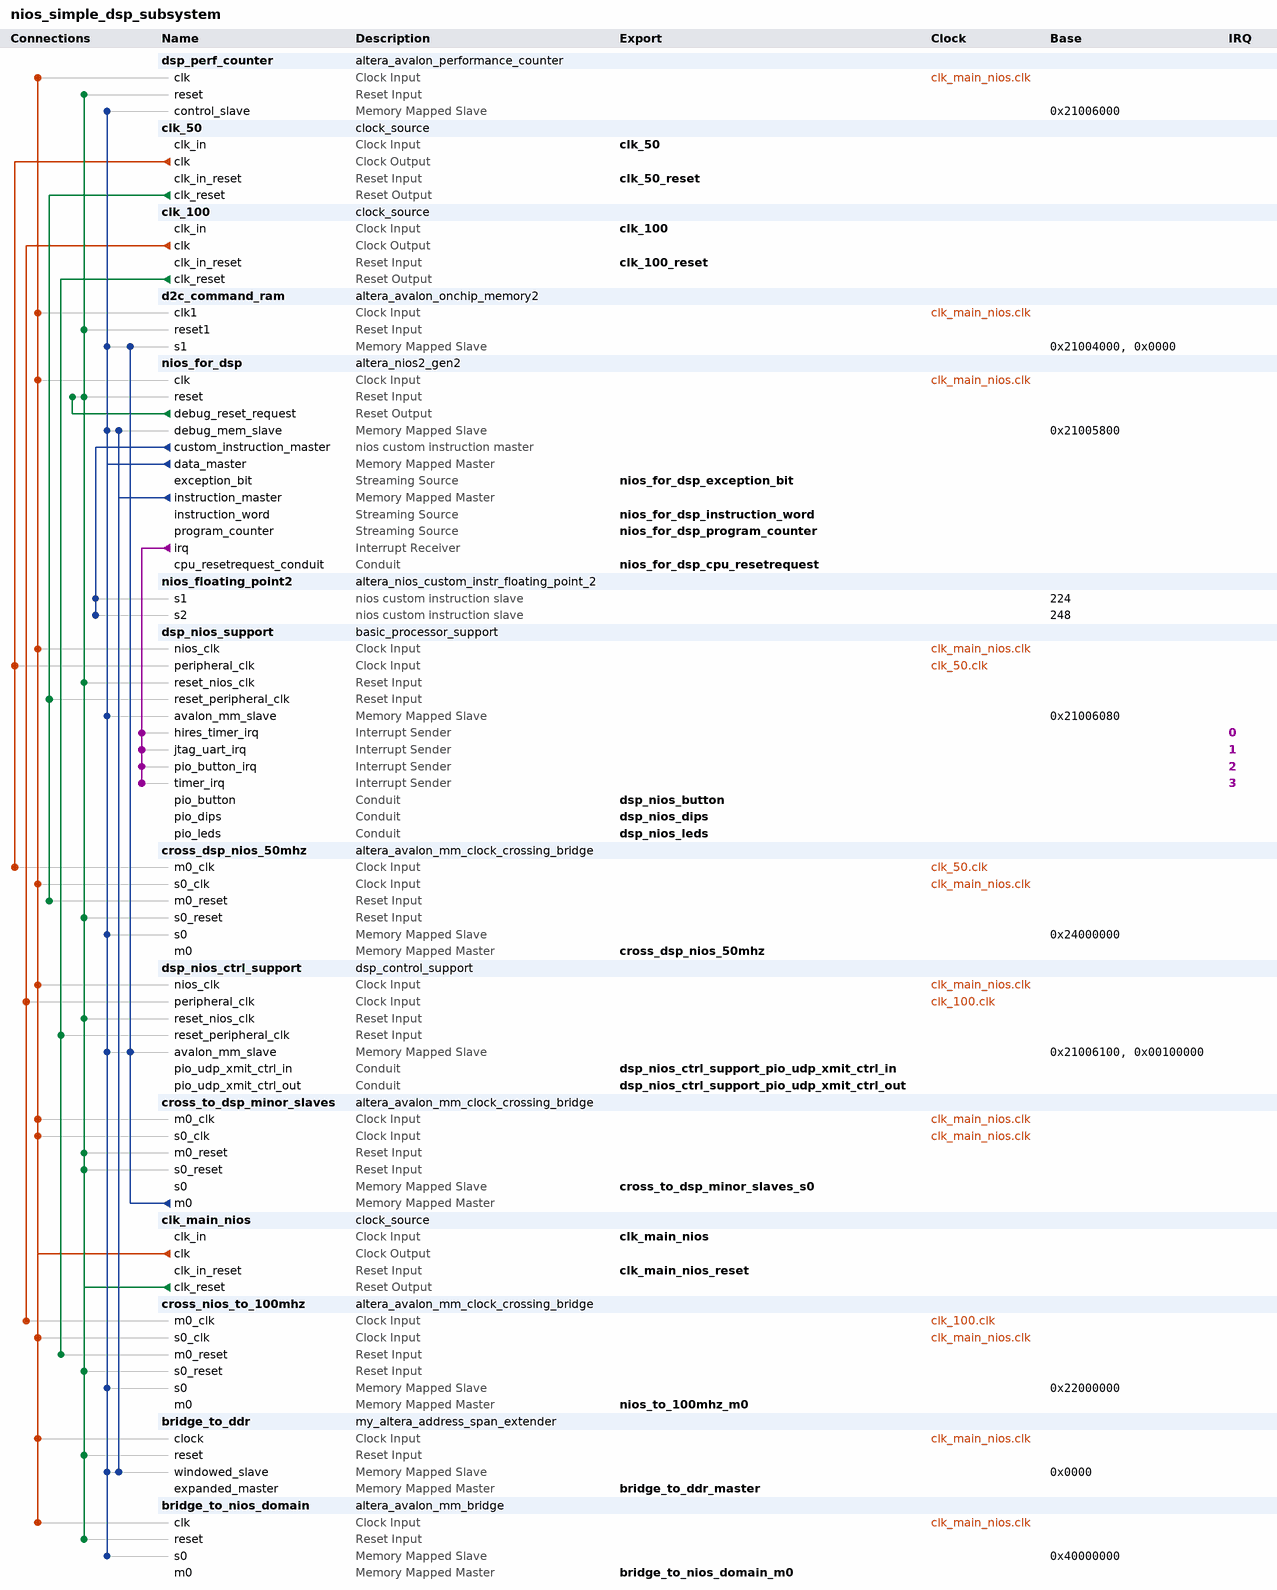
[diagram p0: system contents]
# Platform Designer (Qsys) system nios_simple_dsp_subsystem, Arria V 5AGXFB5H4F35C4
# Parameters at their usual value, and those the tool derives, are not listed.
package require -exact qsys 16.1
create_system nios_simple_dsp_subsystem
set_project_property DEVICE_FAMILY {Arria V}
set_project_property DEVICE 5AGXFB5H4F35C4

add_instance dsp_perf_counter altera_avalon_performance_counter 16.1
set_instance_parameter_value dsp_perf_counter numberOfSections 7

add_instance clk_50 clock_source 16.1
set_instance_parameter_value clk_50 clockFrequency 50000000
set_instance_parameter_value clk_50 resetSynchronousEdges BOTH

add_instance clk_100 clock_source 16.1
set_instance_parameter_value clk_100 clockFrequency 100000000
set_instance_parameter_value clk_100 resetSynchronousEdges BOTH

add_instance d2c_command_ram altera_avalon_onchip_memory2 16.1
set_instance_parameter_value d2c_command_ram allowInSystemMemoryContentEditor true
set_instance_parameter_value d2c_command_ram dataWidth 32
set_instance_parameter_value d2c_command_ram dualPort false
set_instance_parameter_value d2c_command_ram initMemContent true
set_instance_parameter_value d2c_command_ram initializationFileName onchip_mem.hex
set_instance_parameter_value d2c_command_ram instanceID d2c
set_instance_parameter_value d2c_command_ram memorySize 4096
set_instance_parameter_value d2c_command_ram slave1Latency 2

add_instance nios_for_dsp altera_nios2_gen2 16.1
set_instance_parameter_value nios_for_dsp cpuID 3419
set_instance_parameter_value nios_for_dsp cpuReset true
set_instance_parameter_value nios_for_dsp dcache_size 0
set_instance_parameter_value nios_for_dsp dividerType srt2
set_instance_parameter_value nios_for_dsp exceptionSlave bridge_to_ddr.windowed_slave
set_instance_parameter_value nios_for_dsp icache_burstType Sequential
set_instance_parameter_value nios_for_dsp icache_size 16384
set_instance_parameter_value nios_for_dsp impl Fast
set_instance_parameter_value nios_for_dsp mul_32_impl 3
set_instance_parameter_value nios_for_dsp mul_shift_choice 1
set_instance_parameter_value nios_for_dsp resetSlave bridge_to_ddr.windowed_slave
set_instance_parameter_value nios_for_dsp setting_showUnpublishedSettings true
set_instance_parameter_value nios_for_dsp setting_support31bitdcachebypass false

add_instance nios_floating_point2 altera_nios_custom_instr_floating_point_2 16.1
set_instance_parameter_value nios_floating_point2 arithmetic_present true
set_instance_parameter_value nios_floating_point2 comparison_present true
set_instance_parameter_value nios_floating_point2 conversion_present true
set_instance_parameter_value nios_floating_point2 root_present true

add_instance dsp_nios_support basic_processor_support 1.0

add_instance cross_dsp_nios_50mhz altera_avalon_mm_clock_crossing_bridge 16.1
set_instance_parameter_value cross_dsp_nios_50mhz ADDRESS_WIDTH 10
set_instance_parameter_value cross_dsp_nios_50mhz COMMAND_FIFO_DEPTH 4
set_instance_parameter_value cross_dsp_nios_50mhz DATA_WIDTH 32
set_instance_parameter_value cross_dsp_nios_50mhz MASTER_SYNC_DEPTH 2
set_instance_parameter_value cross_dsp_nios_50mhz MAX_BURST_SIZE 1
set_instance_parameter_value cross_dsp_nios_50mhz RESPONSE_FIFO_DEPTH 4
set_instance_parameter_value cross_dsp_nios_50mhz SLAVE_SYNC_DEPTH 2
set_instance_parameter_value cross_dsp_nios_50mhz USE_AUTO_ADDRESS_WIDTH 1

add_instance dsp_nios_ctrl_support dsp_control_support 1.0

add_instance cross_to_dsp_minor_slaves altera_avalon_mm_clock_crossing_bridge 16.1
set_instance_parameter_value cross_to_dsp_minor_slaves ADDRESS_WIDTH 10
set_instance_parameter_value cross_to_dsp_minor_slaves COMMAND_FIFO_DEPTH 16
set_instance_parameter_value cross_to_dsp_minor_slaves DATA_WIDTH 128
set_instance_parameter_value cross_to_dsp_minor_slaves MASTER_SYNC_DEPTH 2
set_instance_parameter_value cross_to_dsp_minor_slaves MAX_BURST_SIZE 1
set_instance_parameter_value cross_to_dsp_minor_slaves RESPONSE_FIFO_DEPTH 16
set_instance_parameter_value cross_to_dsp_minor_slaves SLAVE_SYNC_DEPTH 2
set_instance_parameter_value cross_to_dsp_minor_slaves USE_AUTO_ADDRESS_WIDTH 1

add_instance clk_main_nios clock_source 16.1
set_instance_parameter_value clk_main_nios clockFrequency 150000000
set_instance_parameter_value clk_main_nios resetSynchronousEdges BOTH

add_instance cross_nios_to_100mhz altera_avalon_mm_clock_crossing_bridge 16.1
set_instance_parameter_value cross_nios_to_100mhz ADDRESS_WIDTH 28
set_instance_parameter_value cross_nios_to_100mhz COMMAND_FIFO_DEPTH 4
set_instance_parameter_value cross_nios_to_100mhz DATA_WIDTH 32
set_instance_parameter_value cross_nios_to_100mhz MASTER_SYNC_DEPTH 2
set_instance_parameter_value cross_nios_to_100mhz MAX_BURST_SIZE 1
set_instance_parameter_value cross_nios_to_100mhz RESPONSE_FIFO_DEPTH 4
set_instance_parameter_value cross_nios_to_100mhz SLAVE_SYNC_DEPTH 2
set_instance_parameter_value cross_nios_to_100mhz USE_AUTO_ADDRESS_WIDTH 1

add_instance bridge_to_ddr my_altera_address_span_extender 16.1
set_instance_parameter_value bridge_to_ddr BURSTCOUNT_WIDTH 4
set_instance_parameter_value bridge_to_ddr DATA_WIDTH 256
set_instance_parameter_value bridge_to_ddr ENABLE_SLAVE_PORT true
set_instance_parameter_value bridge_to_ddr MASTER_ADDRESS_DEF 0
set_instance_parameter_value bridge_to_ddr MASTER_ADDRESS_WIDTH 32
set_instance_parameter_value bridge_to_ddr MAX_PENDING_READS 32
set_instance_parameter_value bridge_to_ddr SLAVE_ADDRESS_WIDTH 24
set_instance_parameter_value bridge_to_ddr SUB_WINDOW_COUNT 1

add_instance bridge_to_nios_domain altera_avalon_mm_bridge 16.1
set_instance_parameter_value bridge_to_nios_domain ADDRESS_UNITS SYMBOLS
set_instance_parameter_value bridge_to_nios_domain ADDRESS_WIDTH 10
set_instance_parameter_value bridge_to_nios_domain DATA_WIDTH 32
set_instance_parameter_value bridge_to_nios_domain MAX_PENDING_RESPONSES 4
set_instance_parameter_value bridge_to_nios_domain USE_AUTO_ADDRESS_WIDTH 1

# connections
add_connection clk_50.clk cross_dsp_nios_50mhz.m0_clk clock
add_connection clk_50.clk dsp_nios_support.peripheral_clk clock
add_connection clk_100.clk cross_nios_to_100mhz.m0_clk clock
add_connection clk_100.clk dsp_nios_ctrl_support.peripheral_clk clock
add_connection clk_main_nios.clk bridge_to_ddr.clock clock
add_connection clk_main_nios.clk bridge_to_nios_domain.clk clock
add_connection clk_main_nios.clk cross_dsp_nios_50mhz.s0_clk clock
add_connection clk_main_nios.clk cross_nios_to_100mhz.s0_clk clock
add_connection clk_main_nios.clk cross_to_dsp_minor_slaves.m0_clk clock
add_connection clk_main_nios.clk cross_to_dsp_minor_slaves.s0_clk clock
add_connection clk_main_nios.clk d2c_command_ram.clk1 clock
add_connection clk_main_nios.clk dsp_nios_ctrl_support.nios_clk clock
add_connection clk_main_nios.clk dsp_nios_support.nios_clk clock
add_connection clk_main_nios.clk dsp_perf_counter.clk clock
add_connection clk_main_nios.clk nios_for_dsp.clk clock
add_connection clk_50.clk_reset cross_dsp_nios_50mhz.m0_reset reset
add_connection clk_50.clk_reset dsp_nios_support.reset_peripheral_clk reset
add_connection clk_100.clk_reset cross_nios_to_100mhz.m0_reset reset
add_connection clk_100.clk_reset dsp_nios_ctrl_support.reset_peripheral_clk reset
add_connection clk_main_nios.clk_reset bridge_to_ddr.reset reset
add_connection clk_main_nios.clk_reset bridge_to_nios_domain.reset reset
add_connection clk_main_nios.clk_reset cross_dsp_nios_50mhz.s0_reset reset
add_connection clk_main_nios.clk_reset cross_nios_to_100mhz.s0_reset reset
add_connection clk_main_nios.clk_reset cross_to_dsp_minor_slaves.m0_reset reset
add_connection clk_main_nios.clk_reset cross_to_dsp_minor_slaves.s0_reset reset
add_connection clk_main_nios.clk_reset d2c_command_ram.reset1 reset
add_connection clk_main_nios.clk_reset dsp_nios_ctrl_support.reset_nios_clk reset
add_connection clk_main_nios.clk_reset dsp_nios_support.reset_nios_clk reset
add_connection clk_main_nios.clk_reset dsp_perf_counter.reset reset
add_connection clk_main_nios.clk_reset nios_for_dsp.reset reset
add_connection nios_for_dsp.debug_reset_request nios_for_dsp.reset reset
add_connection cross_to_dsp_minor_slaves.m0 d2c_command_ram.s1 avalon
set_connection_parameter_value cross_to_dsp_minor_slaves.m0/d2c_command_ram.s1 baseAddress 0x0000
add_connection cross_to_dsp_minor_slaves.m0 dsp_nios_ctrl_support.avalon_mm_slave avalon
set_connection_parameter_value cross_to_dsp_minor_slaves.m0/dsp_nios_ctrl_support.avalon_mm_slave baseAddress 0x00100000
add_connection nios_for_dsp.data_master bridge_to_ddr.windowed_slave avalon
set_connection_parameter_value nios_for_dsp.data_master/bridge_to_ddr.windowed_slave baseAddress 0x0000
add_connection nios_for_dsp.data_master bridge_to_nios_domain.s0 avalon
set_connection_parameter_value nios_for_dsp.data_master/bridge_to_nios_domain.s0 baseAddress 0x40000000
add_connection nios_for_dsp.data_master cross_dsp_nios_50mhz.s0 avalon
set_connection_parameter_value nios_for_dsp.data_master/cross_dsp_nios_50mhz.s0 baseAddress 0x24000000
add_connection nios_for_dsp.data_master cross_nios_to_100mhz.s0 avalon
set_connection_parameter_value nios_for_dsp.data_master/cross_nios_to_100mhz.s0 baseAddress 0x22000000
add_connection nios_for_dsp.data_master d2c_command_ram.s1 avalon
set_connection_parameter_value nios_for_dsp.data_master/d2c_command_ram.s1 baseAddress 0x21004000
add_connection nios_for_dsp.data_master dsp_nios_ctrl_support.avalon_mm_slave avalon
set_connection_parameter_value nios_for_dsp.data_master/dsp_nios_ctrl_support.avalon_mm_slave baseAddress 0x21006100
add_connection nios_for_dsp.data_master dsp_nios_support.avalon_mm_slave avalon
set_connection_parameter_value nios_for_dsp.data_master/dsp_nios_support.avalon_mm_slave baseAddress 0x21006080
add_connection nios_for_dsp.data_master dsp_perf_counter.control_slave avalon
set_connection_parameter_value nios_for_dsp.data_master/dsp_perf_counter.control_slave baseAddress 0x21006000
add_connection nios_for_dsp.data_master nios_for_dsp.debug_mem_slave avalon
set_connection_parameter_value nios_for_dsp.data_master/nios_for_dsp.debug_mem_slave baseAddress 0x21005800
add_connection nios_for_dsp.instruction_master bridge_to_ddr.windowed_slave avalon
set_connection_parameter_value nios_for_dsp.instruction_master/bridge_to_ddr.windowed_slave baseAddress 0x0000
add_connection nios_for_dsp.instruction_master nios_for_dsp.debug_mem_slave avalon
set_connection_parameter_value nios_for_dsp.instruction_master/nios_for_dsp.debug_mem_slave baseAddress 0x21005800
add_connection nios_for_dsp.irq dsp_nios_support.hires_timer_irq interrupt
set_connection_parameter_value nios_for_dsp.irq/dsp_nios_support.hires_timer_irq irqNumber 0
add_connection nios_for_dsp.irq dsp_nios_support.jtag_uart_irq interrupt
set_connection_parameter_value nios_for_dsp.irq/dsp_nios_support.jtag_uart_irq irqNumber 1
add_connection nios_for_dsp.irq dsp_nios_support.pio_button_irq interrupt
set_connection_parameter_value nios_for_dsp.irq/dsp_nios_support.pio_button_irq irqNumber 2
add_connection nios_for_dsp.irq dsp_nios_support.timer_irq interrupt
set_connection_parameter_value nios_for_dsp.irq/dsp_nios_support.timer_irq irqNumber 3
add_connection nios_for_dsp.custom_instruction_master nios_floating_point2.s1 nios_custom_instruction
set_connection_parameter_value nios_for_dsp.custom_instruction_master/nios_floating_point2.s1 CIName nios_floating_point2
set_connection_parameter_value nios_for_dsp.custom_instruction_master/nios_floating_point2.s1 baseAddress 224
add_connection nios_for_dsp.custom_instruction_master nios_floating_point2.s2 nios_custom_instruction
set_connection_parameter_value nios_for_dsp.custom_instruction_master/nios_floating_point2.s2 CIName nios_floating_point2_1
set_connection_parameter_value nios_for_dsp.custom_instruction_master/nios_floating_point2.s2 baseAddress 248

# exported interfaces
add_interface bridge_to_ddr_master avalon master
set_interface_property bridge_to_ddr_master EXPORT_OF bridge_to_ddr.expanded_master
add_interface bridge_to_nios_domain_m0 avalon master
set_interface_property bridge_to_nios_domain_m0 EXPORT_OF bridge_to_nios_domain.m0
add_interface clk_100 clock sink
set_interface_property clk_100 EXPORT_OF clk_100.clk_in
add_interface clk_100_reset reset sink
set_interface_property clk_100_reset EXPORT_OF clk_100.clk_in_reset
add_interface clk_50 clock sink
set_interface_property clk_50 EXPORT_OF clk_50.clk_in
add_interface clk_50_reset reset sink
set_interface_property clk_50_reset EXPORT_OF clk_50.clk_in_reset
add_interface clk_main_nios clock sink
set_interface_property clk_main_nios EXPORT_OF clk_main_nios.clk_in
add_interface clk_main_nios_reset reset sink
set_interface_property clk_main_nios_reset EXPORT_OF clk_main_nios.clk_in_reset
add_interface cross_dsp_nios_50mhz avalon master
set_interface_property cross_dsp_nios_50mhz EXPORT_OF cross_dsp_nios_50mhz.m0
add_interface cross_to_dsp_minor_slaves_s0 avalon slave
set_interface_property cross_to_dsp_minor_slaves_s0 EXPORT_OF cross_to_dsp_minor_slaves.s0
add_interface dsp_nios_button conduit end
set_interface_property dsp_nios_button EXPORT_OF dsp_nios_support.pio_button
add_interface dsp_nios_ctrl_support_pio_udp_xmit_ctrl_in conduit end
set_interface_property dsp_nios_ctrl_support_pio_udp_xmit_ctrl_in EXPORT_OF dsp_nios_ctrl_support.pio_udp_xmit_ctrl_in
add_interface dsp_nios_ctrl_support_pio_udp_xmit_ctrl_out conduit end
set_interface_property dsp_nios_ctrl_support_pio_udp_xmit_ctrl_out EXPORT_OF dsp_nios_ctrl_support.pio_udp_xmit_ctrl_out
add_interface dsp_nios_dips conduit end
set_interface_property dsp_nios_dips EXPORT_OF dsp_nios_support.pio_dips
add_interface dsp_nios_leds conduit end
set_interface_property dsp_nios_leds EXPORT_OF dsp_nios_support.pio_leds
add_interface nios_for_dsp_cpu_resetrequest conduit end
set_interface_property nios_for_dsp_cpu_resetrequest EXPORT_OF nios_for_dsp.cpu_resetrequest_conduit
add_interface nios_for_dsp_exception_bit avalon_streaming source
set_interface_property nios_for_dsp_exception_bit EXPORT_OF nios_for_dsp.exception_bit
add_interface nios_for_dsp_instruction_word avalon_streaming source
set_interface_property nios_for_dsp_instruction_word EXPORT_OF nios_for_dsp.instruction_word
add_interface nios_for_dsp_program_counter avalon_streaming source
set_interface_property nios_for_dsp_program_counter EXPORT_OF nios_for_dsp.program_counter
add_interface nios_to_100mhz_m0 avalon master
set_interface_property nios_to_100mhz_m0 EXPORT_OF cross_nios_to_100mhz.m0

set_interconnect_requirement {$system} qsys_mm.clockCrossingAdapter AUTO
set_interconnect_requirement {$system} qsys_mm.insertDefaultSlave FALSE
set_interconnect_requirement {$system} qsys_mm.maxAdditionalLatency 4

save_system nios_simple_dsp_subsystem.qsys
